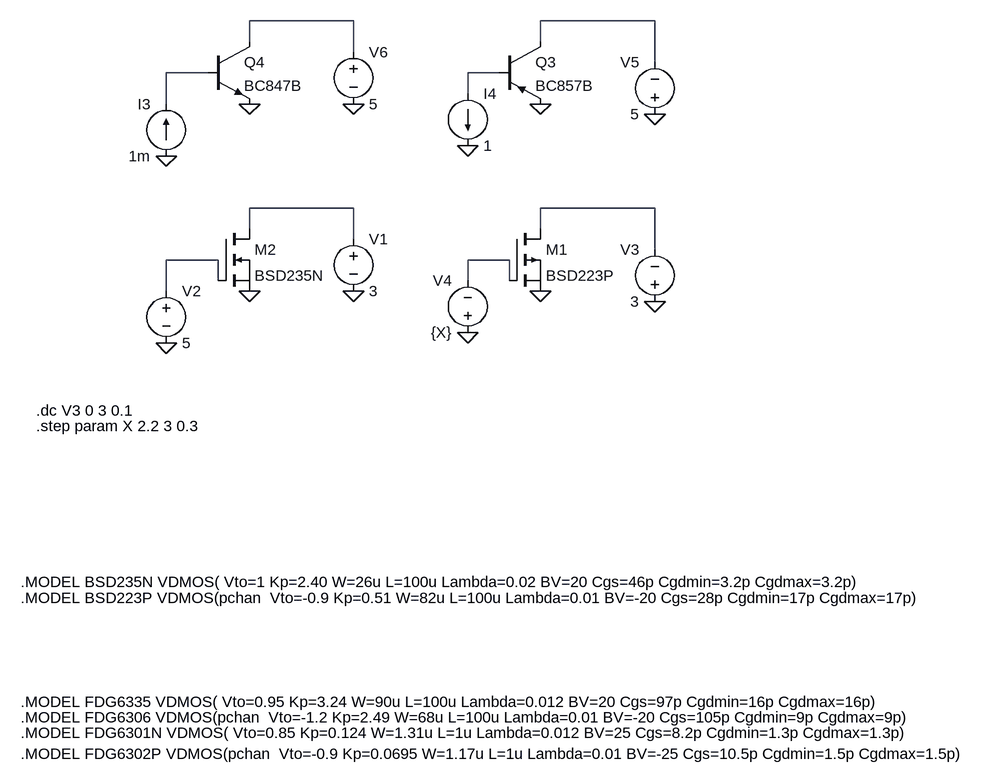
[diagram p0: schematic MOS_Modeling.asc]
MOS_Modeling.asc, the LTspice schematic file:
Version 4
SHEET 1 1388 904
WIRE 320 -240 160 -240
WIRE 784 -240 608 -240
WIRE 160 -208 160 -240
WIRE 608 -208 608 -240
WIRE 320 -192 320 -240
WIRE 784 -176 784 -240
WIRE 96 -160 32 -160
WIRE 544 -160 496 -160
WIRE 496 -128 496 -160
WIRE 32 -112 32 -160
WIRE 320 48 160 48
WIRE 784 48 608 48
WIRE 160 80 160 48
WIRE 608 80 608 48
WIRE 320 96 320 48
WIRE 784 112 784 48
WIRE 112 128 32 128
WIRE 560 128 496 128
WIRE 112 160 112 128
WIRE 496 160 496 128
WIRE 560 160 560 128
WIRE 32 176 32 128
FLAG 32 256 0
FLAG 160 176 0
FLAG 320 176 0
FLAG 608 176 0
FLAG 496 240 0
FLAG 784 192 0
FLAG 32 -32 0
FLAG 160 -112 0
FLAG 320 -112 0
FLAG 608 -112 0
FLAG 496 -48 0
FLAG 784 -96 0
SYMBOL voltage 320 80 R0
SYMATTR InstName V1
SYMATTR Value 3
SYMBOL voltage 784 208 R180
WINDOW 0 24 96 Left 2
WINDOW 3 24 16 Left 2
WINDOW 123 0 0 Left 0
WINDOW 39 0 0 Left 0
SYMATTR InstName V3
SYMATTR Value 3
SYMBOL voltage 320 -208 R0
SYMATTR InstName V6
SYMATTR Value 5
SYMBOL voltage 784 -80 R180
WINDOW 0 24 96 Left 2
WINDOW 3 24 16 Left 2
WINDOW 123 0 0 Left 0
WINDOW 39 0 0 Left 0
SYMATTR InstName V5
SYMATTR Value 5
SYMBOL pnp 544 -208 R0
SYMATTR InstName Q3
SYMATTR Value BC857B
SYMBOL npn 96 -208 R0
SYMATTR InstName Q4
SYMATTR Value BC847B
SYMBOL current 32 -32 R180
WINDOW 0 24 80 Left 2
WINDOW 3 24 0 Left 2
SYMATTR InstName I3
SYMATTR Value 1m
SYMBOL current 496 -128 R0
SYMATTR InstName I4
SYMATTR Value 1
SYMBOL voltage 32 160 R0
SYMATTR InstName V2
SYMATTR Value 5
SYMBOL voltage 496 256 R180
WINDOW 0 24 96 Left 2
WINDOW 3 24 16 Left 2
SYMATTR InstName V4
SYMATTR Value {X}
SYMBOL pmos 560 80 R0
SYMATTR InstName M1
SYMATTR Value BSD223P
SYMBOL nmos 112 80 R0
SYMATTR InstName M2
SYMATTR Value BSD235N
TEXT -192 624 Left 2 !.MODEL BSD235N VDMOS( Vto=1 Kp=2.40 W=26u L=100u Lambda=0.02 BV=20 Cgs=46p Cgdmin=3.2p Cgdmax=3.2p)
TEXT -168 360 Left 2 !.dc V3 0 3 0.1
TEXT -192 648 Left 2 !.MODEL BSD223P VDMOS(pchan  Vto=-0.9 Kp=0.51 W=82u L=100u Lambda=0.01 BV=-20 Cgs=28p Cgdmin=17p Cgdmax=17p)
TEXT -192 856 Left 2 !.MODEL FDG6301N VDMOS( Vto=0.85 Kp=0.124 W=1.31u L=1u Lambda=0.012 BV=25 Cgs=8.2p Cgdmin=1.3p Cgdmax=1.3p)
TEXT -192 888 Left 2 !.MODEL FDG6302P VDMOS(pchan  Vto=-0.9 Kp=0.0695 W=1.17u L=1u Lambda=0.01 BV=-25 Cgs=10.5p Cgdmin=1.5p Cgdmax=1.5p)
TEXT -168 384 Left 2 !.step param X 2.2 3 0.3
TEXT -192 808 Left 2 !.MODEL FDG6335 VDMOS( Vto=0.95 Kp=3.24 W=90u L=100u Lambda=0.012 BV=20 Cgs=97p Cgdmin=16p Cgdmax=16p)
TEXT -192 832 Left 2 !.MODEL FDG6306 VDMOS(pchan  Vto=-1.2 Kp=2.49 W=68u L=100u Lambda=0.01 BV=-20 Cgs=105p Cgdmin=9p Cgdmax=9p)

The netlist it stands for:
* MOS_Modeling.asc
V1 N005 0 3
V3 0 N006 3
V6 N001 0 5
V5 0 N002 5
Q3 N002 N004 0 0 BC857B
Q4 N001 N003 0 0 BC847B
I3 0 N003 1m
I4 N004 0 1
V2 N007 0 5
V4 0 N008 {X}
M1 N006 N008 0 0 BSD223P
M2 N005 N007 0 0 BSD235N
.model NPN NPN
.model PNP PNP
.lib standard.bjt
.model NMOS NMOS
.model PMOS PMOS
.lib standard.mos
.MODEL BSD235N VDMOS( Vto=1 Kp=2.40 W=26u L=100u Lambda=0.02 BV=20 Cgs=46p Cgdmin=3.2p Cgdmax=3.2p)
.dc V3 0 3 0.1
.MODEL BSD223P VDMOS(pchan  Vto=-0.9 Kp=0.51 W=82u L=100u Lambda=0.01 BV=-20 Cgs=28p Cgdmin=17p Cgdmax=17p)
.MODEL FDG6301N VDMOS( Vto=0.85 Kp=0.124 W=1.31u L=1u Lambda=0.012 BV=25 Cgs=8.2p Cgdmin=1.3p Cgdmax=1.3p)
.MODEL FDG6302P VDMOS(pchan  Vto=-0.9 Kp=0.0695 W=1.17u L=1u Lambda=0.01 BV=-25 Cgs=10.5p Cgdmin=1.5p Cgdmax=1.5p)
.step param X 2.2 3 0.3
.MODEL FDG6335 VDMOS( Vto=0.95 Kp=3.24 W=90u L=100u Lambda=0.012 BV=20 Cgs=97p Cgdmin=16p Cgdmax=16p)
.MODEL FDG6306 VDMOS(pchan  Vto=-1.2 Kp=2.49 W=68u L=100u Lambda=0.01 BV=-20 Cgs=105p Cgdmin=9p Cgdmax=9p)
.backanno
.end